# Altium schematic sheet USB.SchDoc: USB
size A4; Date: 6.4.2015; Engineer: Matjaž Tome; DocumentNumber: 6; Revision: B; SheetNumber: 4; SheetTotal: 10; Project: USB DAQ
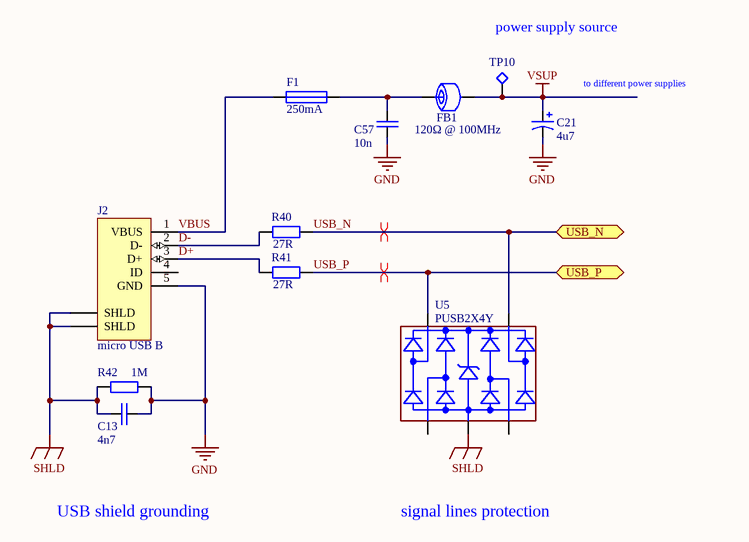
[diagram p0: USB.SchDoc]

## Parts
C13  value 4n7  [C_0603]  (hidden comment: comment)
C21  value 4u7  [Tantalum Case A]  (hidden comment: comment)
C57  value 10n  [C_0603]  (hidden comment: comment)
F1  250mA  [PPTCF 1206]
FB1  120Ω @ 100MHz  [SMD_0805]
J2  micro USB B  [MICRO_USB_A]
R40  value 27R  [R_0603]  (hidden comment: comment)
R41  value 27R  [R_0603]  (hidden comment: comment)
R42  value 1M  [R_0603]  (hidden comment: comment)
TP10  testpoint  [TP1_FULL]  (value not drawn)
U5  PUSB2X4Y  [SOT363]

## Ports
USB_N (bidir), USB_P (bidir)

## Nets
GND: C13.1 C21.2 C57.2 J2.5(GND) R42.1
SHLD: C13.2 J2.6(SHLD) J2.7(SHLD) R42.2 U5.2
VSUP: C21.1 FB1.2 TP10.1
D+: J2.3(D+) R41.1
D-: J2.2(D-) R40.1
USB_N: R40.2 U5.4 ; port USB_N
USB_P: R41.2 U5.6 ; port USB_P
VBUS: F1.1 J2.1(VBUS)
NetC57_1: C57.1 F1.2 FB1.1

Not connected (* = marked no-connect by the designer): J2 4(ID); U5 1 3

## Layout directives
differential pair: USB_N, USB_P

## Notes on the sheet
- power supply source
- (near C21) to different power supplies
- USB shield grounding
- signal lines protection
- Title
- Date
- Project
- Rev
- Engineer
- Sheet
- of

## Library data of the parts
C13 C57 = Capacitor: Generic capacitor
C21 = Capacitor - polarized: Generic polarized capacitor
F1 = 1206L025YR: Resettable Fuse, PPTC, 1206 (3216 Metric), POLYFUSE 1206L Series, 16 VDC, 250 mA, 500 mA, 0.08 s; Manufacturer: Littelfuse; Manufacturer Number: 2920L030DR; Dealer number: 1596990; Dealer: Farnell; Trip current: 500mA; Max voltage: 16V; Resistance: 2.3Ω; Category: Fuses; Price: 0.46; Type: Poly fuse; Holing current: 250mA; Technology: SMT; HelpURL: https://www.farnell.com/datasheets/683946.pdf
FB1 = BLM21AG121SN1D: Ferrite Bead, 0805 [2012 Metric], 120 ohm, 800 mA, BLM21A Series, 0.15 ohm, ± 25%; Manufacturer: Murata; Dealer number: 1515617; Dealer: Farnell; DC resistance: 0.15Ω; Max current: 0.2A; Category: ferite beads; Price: 0.082; Manufacturer Number: BLM21AG121SN1D; AC resistance: 120Ω; Frequency: 100MHz; Case: 0805; Technology: SMT; HelpURL: https://www.farnell.com/datasheets/1914683.pdf
J2 = 10104111-0001LF: USB Connector, Micro USB Type AB, USB 2.0, Receptacle, 5 Ways, Surface Mount, Right Angle; Manufacturer: FCI; Dealer number: 2293755; Dealer: Farnell; Category: Connectors; Price: 0.37; Manufacturer Number: 10104111-0001LF; Gender: Receptacle; Type: A; Size: micro; Technology: SMT / SMT; HelpURL: https://www.farnell.com/cad/2354255.pdf
R40-R42 = Resistor: Generic resistor
TP10 = Test Point: testpoint 1.5mm diameter no hole; Part Number: XXC0006; Category: testpoints
U5 = PUSB2X4Y: ESD protection for high-speed interfaces; Part Number: XDE0000; Manufacturer: Multicomp; Dealer number: 2400968; Dealer: Farnell; Clamping voltage: 3.8V; Category: diode array; Price: 0.174; Manufacturer Number: PUSB2X4Y; Case: SOT363; Technology: SMT; HelpURL: https://www.farnell.com/datasheets/1801208.pdf